# EAGLE design 2 byte output (EAGLE 9.4.2)
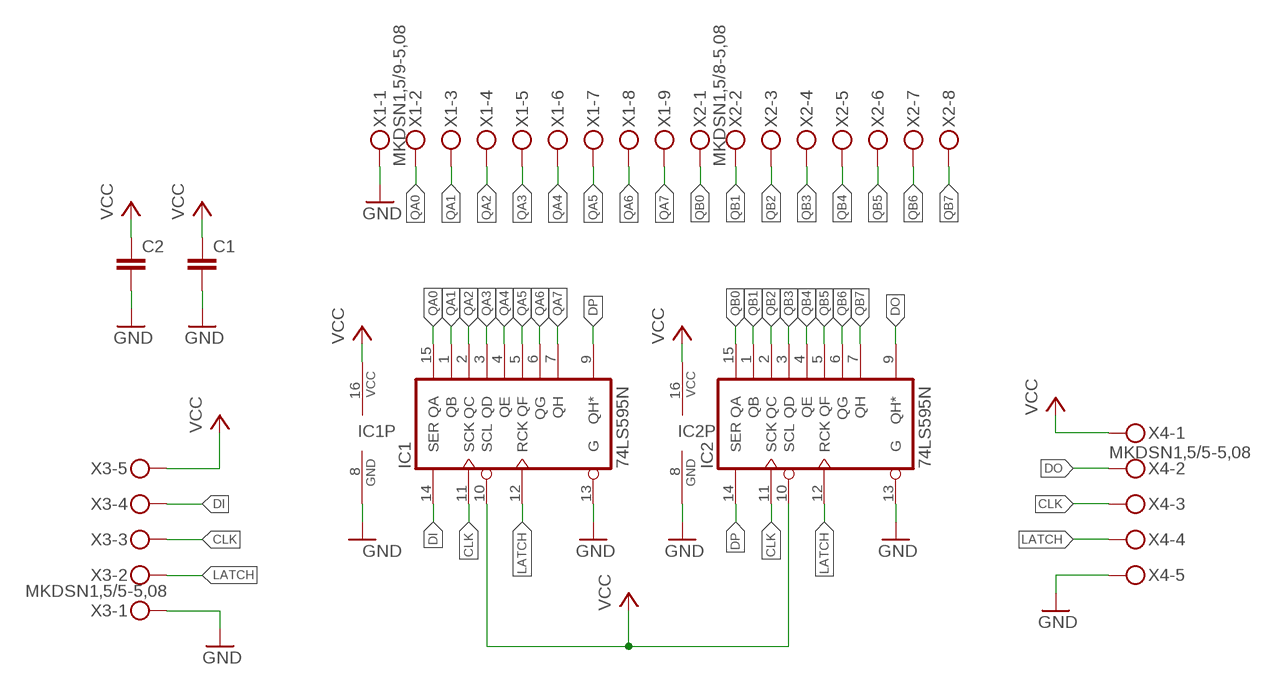
[diagram p0: schematic, sheet 1]

## Parts
C1  C-EU050-035X075  [C050-035X075]
C2  C-EU050-035X075  [C050-035X075]
IC1  74LS595N  [DIL16]
IC2  74LS595N  [DIL16]
X1  MKDSN1,5/9-5,08  [MKDSN1,5/9-5,08]
X2  MKDSN1,5/8-5,08  [MKDSN1,5/8-5,08]
X3  MKDSN1,5/5-5,08  [MKDSN1,5/5-5,08]
X4  MKDSN1,5/5-5,08  [MKDSN1,5/5-5,08]

## Nets
CLK: IC1.11(SCK) IC2.11(SCK) X3.3 X4.3
DI: IC1.14(SER) X3.4
DO: IC2.9(QH*) X4.2
DP: IC1.9(QH*) IC2.14(SER)
GND: C1.2 C2.2 IC1.8(GND) IC1.13(G) IC2.8(GND) IC2.13(G) X1.1 X3.1 X4.5
LATCH: IC1.12(RCK) IC2.12(RCK) X3.2 X4.4
QA0: IC1.15(QA) X1.2
QA1: IC1.1(QB) X1.3
QA2: IC1.2(QC) X1.4
QA3: IC1.3(QD) X1.5
QA4: IC1.4(QE) X1.6
QA5: IC1.5(QF) X1.7
QA6: IC1.6(QG) X1.8
QA7: IC1.7(QH) X1.9
QB0: IC2.15(QA) X2.1
QB1: IC2.1(QB) X2.2
QB2: IC2.2(QC) X2.3
QB3: IC2.3(QD) X2.4
QB4: IC2.4(QE) X2.5
QB5: IC2.5(QF) X2.6
QB6: IC2.6(QG) X2.7
QB7: IC2.7(QH) X2.8
VCC: C1.1 C2.1 IC1.10(SCL) IC1.16(VCC) IC2.10(SCL) IC2.16(VCC) X3.5 X4.1

## Library data of the parts
C1 C2 = resistor:C-EU: CAPACITOR, European symbol
IC1 IC2 = 74xx-us:74*595: 8-bit SHIFT REGISTER, output latch
X1 = con-phoenix-508:MKDSN1,5/9-5,08: MKDSN 1,5/ 9-5,08 Printklemme Nennstrom: 13,5 A Nennspannung: 250 V Rastermaß: 5,08 mm Polzahl: 9 Anschlussart: Schraubanschluss Montage: Löten Anschlussrichtung Leiter/Platine: 0 ° Artikelnummer: 1729199 Source: http://eshop.phoenixcontact.com .. 1729199.pdf
X2 = con-phoenix-508:MKDSN1,5/8-5,08: MKDSN 1,5/ 8-5,08 Printklemme Nennstrom: 13,5 A Nennspannung: 250 V Rastermaß: 5,08 mm Polzahl: 8 Anschlussart: Schraubanschluss Montage: Löten Anschlussrichtung Leiter/Platine: 0 ° Artikelnummer: 1729186 Source: http://eshop.phoenixcontact.com .. 1729186.pdf
X3 X4 = con-phoenix-508:MKDSN1,5/5-5,08: MKDSN 1,5/ 5-5,08 Printklemme Nennstrom: 13,5 A Nennspannung: 250 V Rastermaß: 5,08 mm Polzahl: 5 Anschlussart: Schraubanschluss Montage: Löten Anschlussrichtung Leiter/Platine: 0 ° Artikelnummer: 1729157 Source: http://eshop.phoenixcontact.com .. 1729157.pdf

## Board
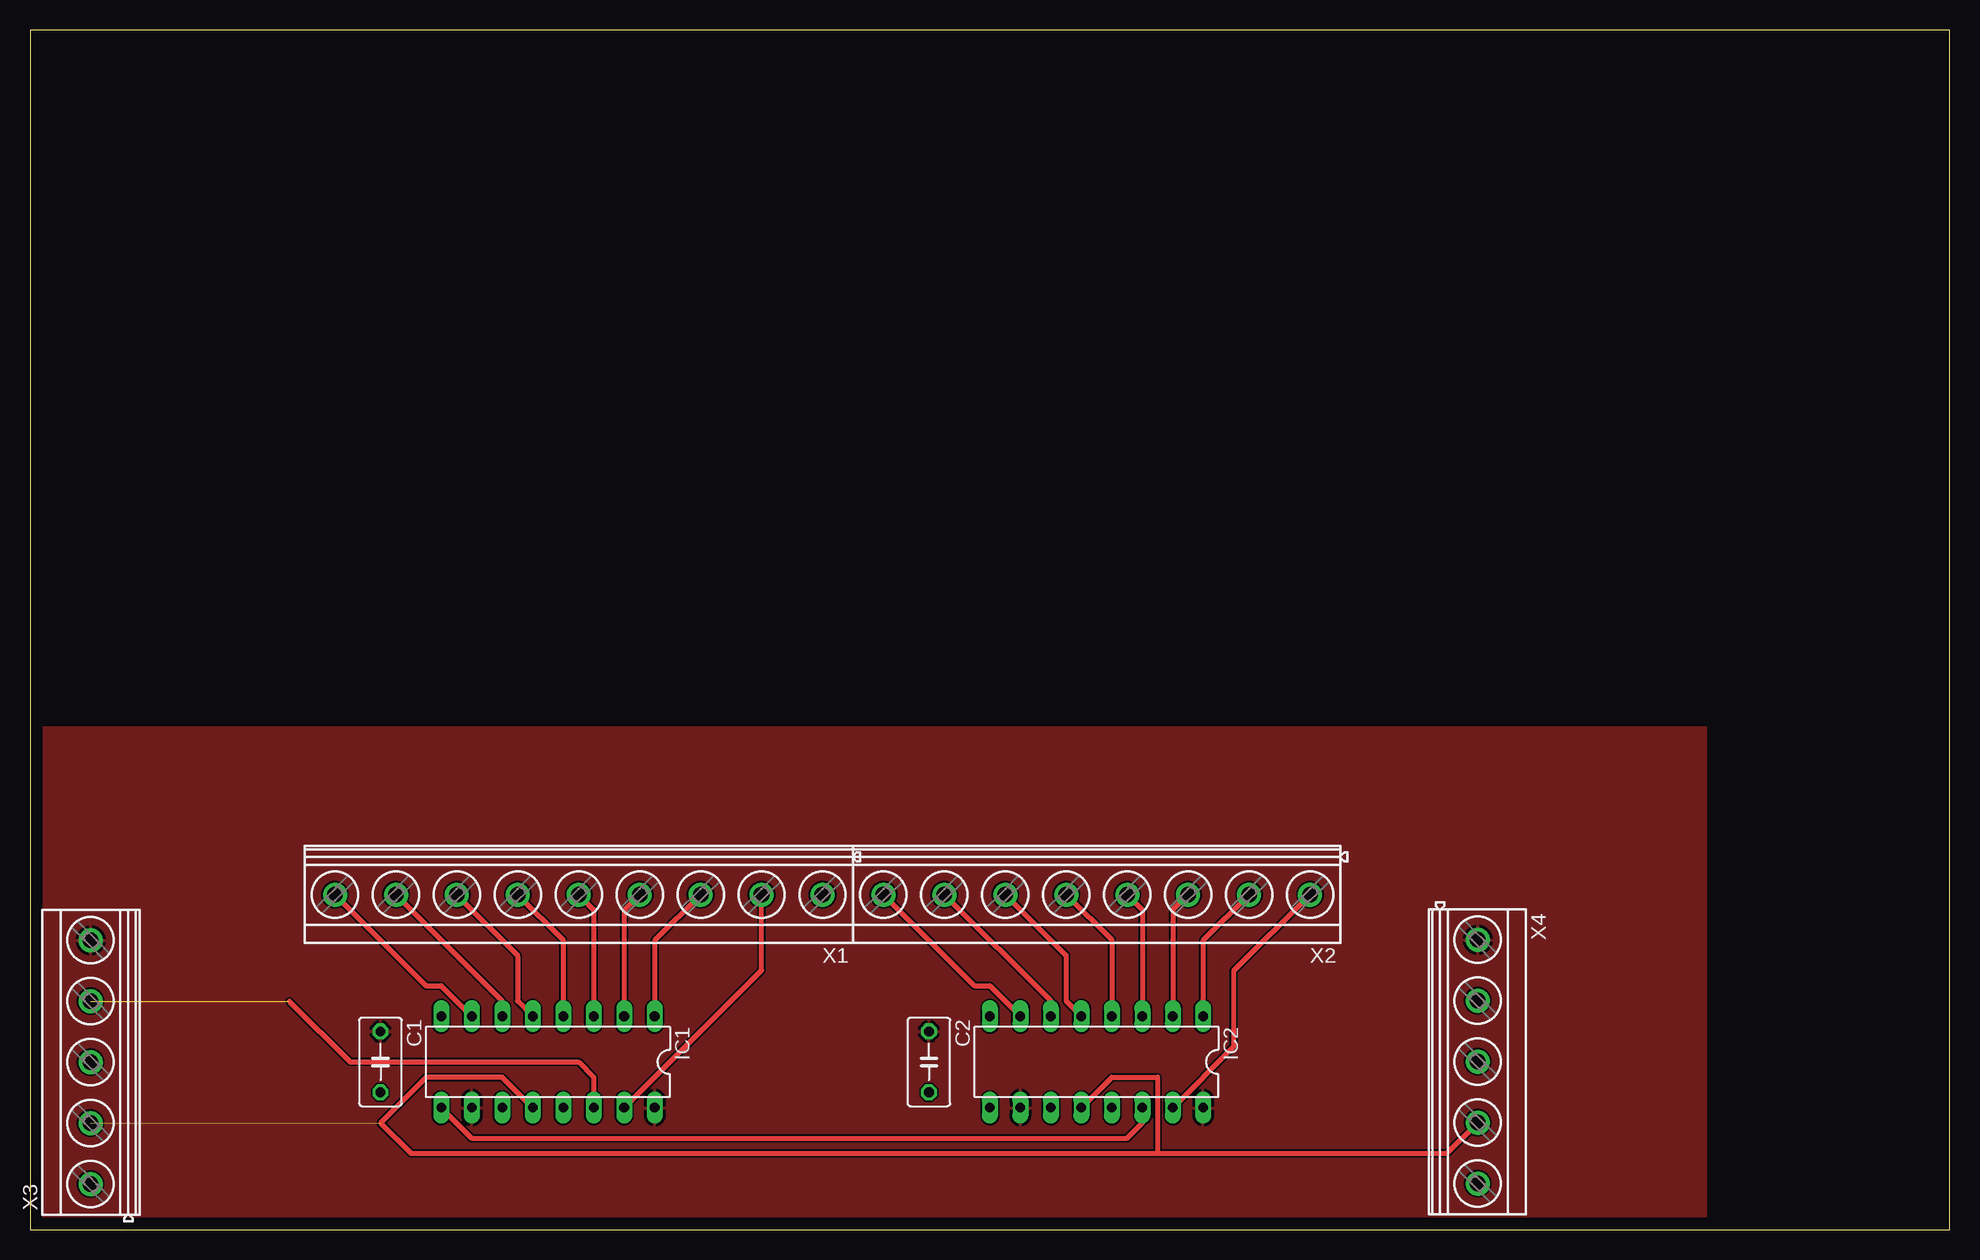
[diagram p1: board, top side]
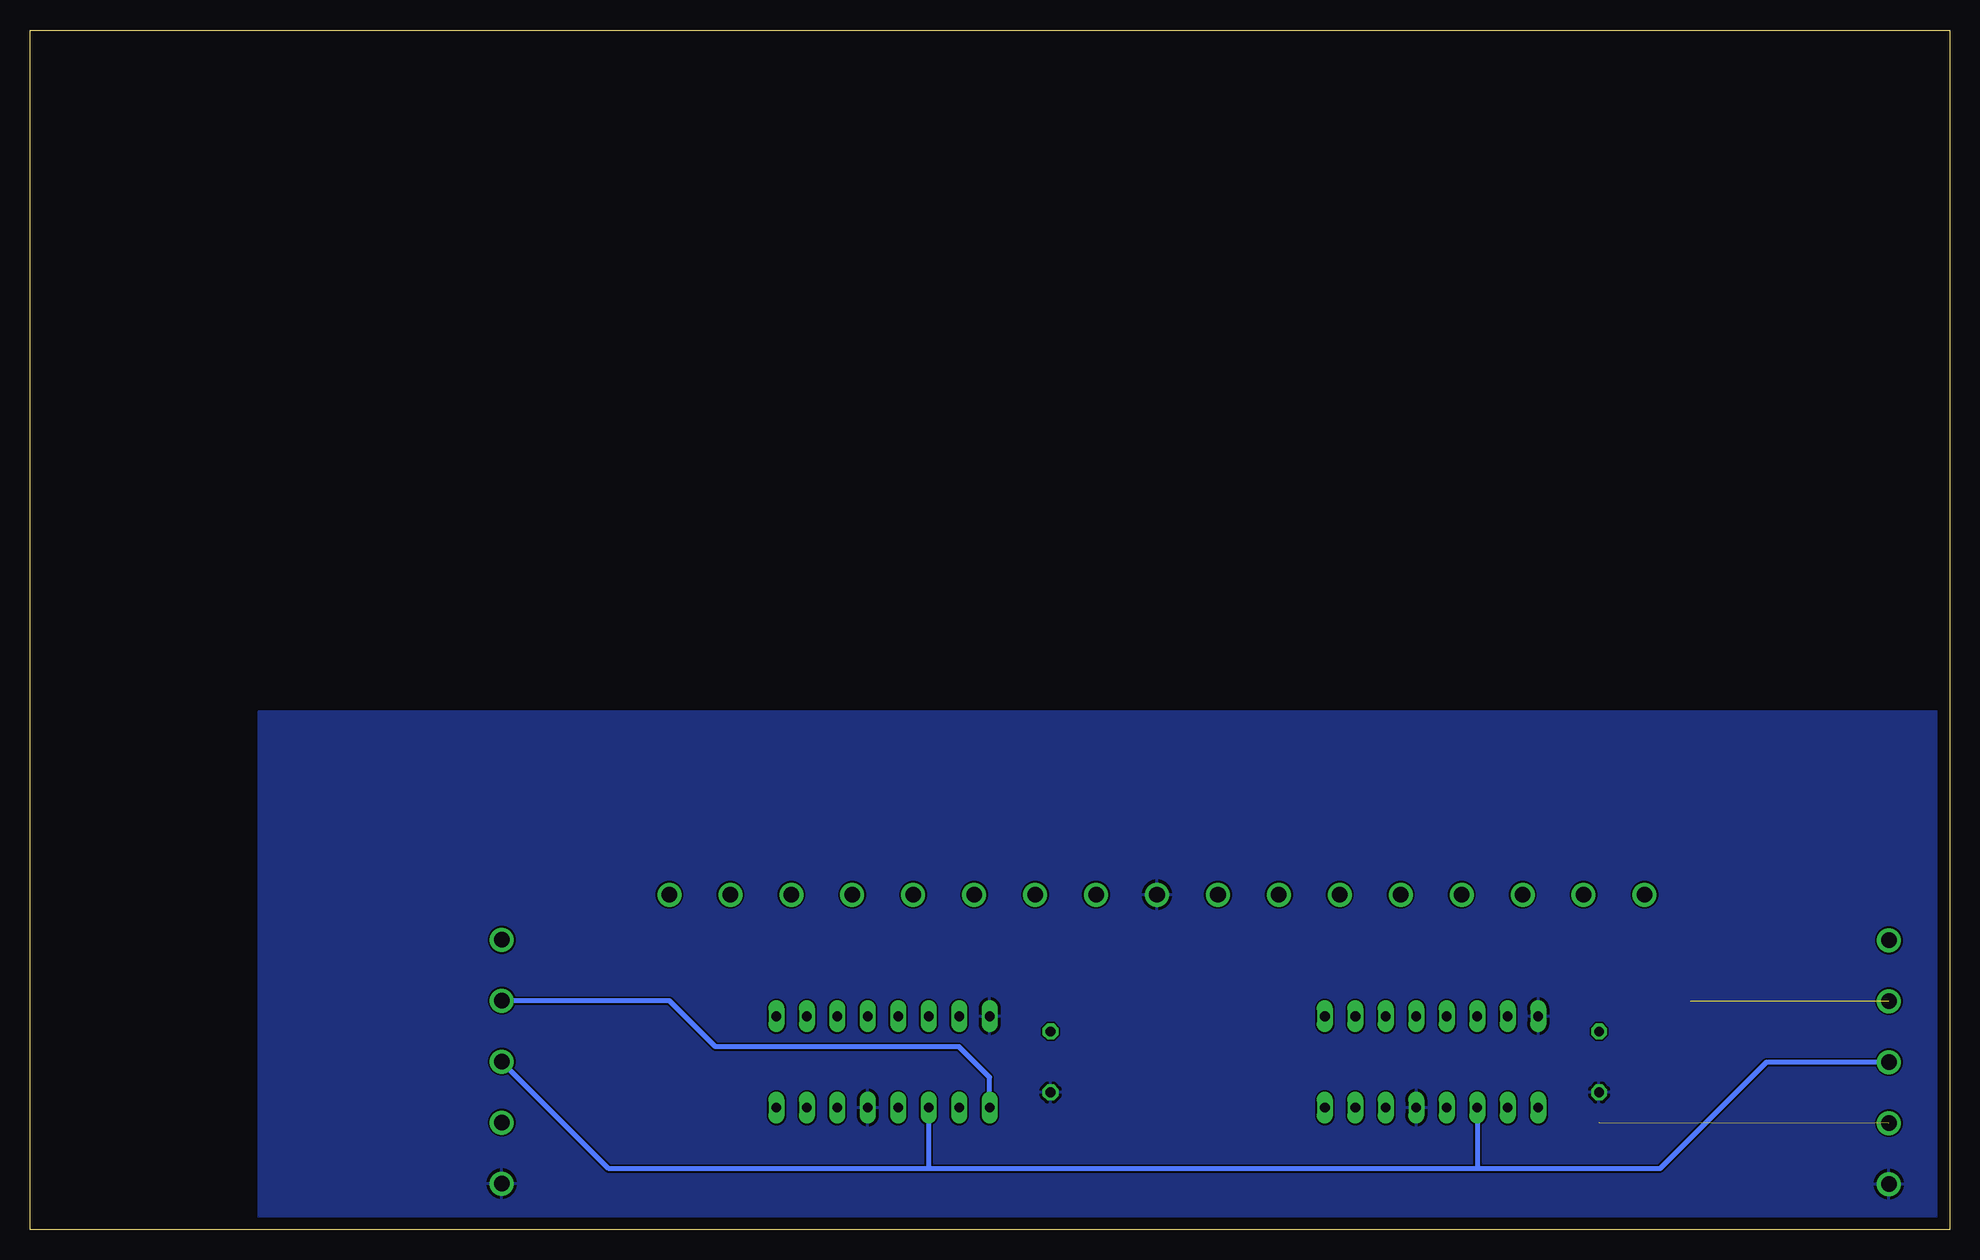
[diagram p2: board, bottom side, seen from below]

Size 160 x 100 mm. Coordinates in mm from the lower left corner, seen from the top.
Outline: 0,0 160,0 160,100 0,100 0,0
Copper layers (1*16): Top 0.035mm / dielectric 1.5mm / Bottom 0.035mm
Design rules "default": minimum track width 6mil, minimum drill 0.35mm, track to track 6mil, track to pad 6mil, pad to pad 6mil, via to via 6mil, smd to smd 6mil, copper to edge 40mil, drill to drill 6mil, minimum pad ring 10mil, minimum via ring 8mil, stop-mask expansion 4mil, vias tented up to drill 0mil, thermal gap 10mil

### Footprints (pad centres in the part's own frame; a part is rotated, then mirrored left to right if it is on the bottom)
C050-035X075 = drill 0.813 octagon: 1 -2.54,0; 2 2.54,0
DIL16 = drill 0.813 long: 1 -8.89,-3.81; 2 -6.35,-3.81; 3 -3.81,-3.81; 4 -1.27,-3.81; 5 1.27,-3.81; 6 3.81,-3.81; 7 6.35,-3.81; 8 8.89,-3.81; 9 8.89,3.81; 10 6.35,3.81; 11 3.81,3.81; 12 1.27,3.81; 13 -1.27,3.81; 14 -3.81,3.81; 15 -6.35,3.81; 16 -8.89,3.81
MKDSN1,5/9-5,08 = drill 1.3 pad 2: 1 -20.341,0.025; 2 -15.261,0.025; 3 -10.181,0.025; 4 -5.101,0.025; 5 -0.021,0.025; 6 5.059,0.025; 7 10.139,0.025; 8 15.219,0.025; 9 20.299,0.025
MKDSN1,5/8-5,08 = drill 1.3 pad 2: 1 -17.801,0.025; 2 -12.721,0.025; 3 -7.641,0.025; 4 -2.561,0.025; 5 2.519,0.025; 6 7.599,0.025; 7 12.679,0.025; 8 17.759,0.025
MKDSN1,5/5-5,08 = drill 1.3 pad 2: 1 -10.181,0.025; 2 -5.101,0.025; 3 -0.021,0.025; 4 5.059,0.025; 5 10.139,0.025

### Placement (x,y rotation side)
C1  29.21,13.97 270 top
C2  74.93,13.97 270 top
IC1  43.18,13.97 180 top
IC2  88.9,13.97 180 top
X1  45.72,27.94 180 top
X2  88.9,27.94 180 top
X3  5.08,13.97 90 top
X4  120.65,13.97 270 top

### Tracks (layer width: path | path; a pad name or v marks a point on that pad's centre or on a via)
CLK
  Bottom 0.406: X3.3 15.26,13.95 24.13,5.08 39.37,5.08 | 39.37,5.08 85.09,5.08 | 85.09,5.08 111.76,5.08 X4.3 | IC1.11 39.37,5.08 | IC2.11 85.09,5.08
DI  (1 unrouted)
  Top 0.406: 21.61,19.03 26.67,13.97 45.72,13.97 46.99,12.7 IC1.14
DO
  Bottom 0.406: IC2.9 80.01,12.7 82.55,15.24 102.87,15.24 106.7,19.07 X4.2
DP
  Top 0.406: IC1.9 36.83,7.62 91.44,7.62 92.71,8.89 IC2.14
GND
  pour Bottom: -6.35,43.18 140.97,43.18 140.97,-3.81 -6.35,-3.81
LATCH  (1 unrouted)
  Top 0.406: 93.98,6.35 31.75,6.35 29.23,8.87 29.23,8.91 33.02,12.7 39.37,12.7 IC1.12 | 93.98,6.35 118.11,6.35 X4.4 | IC2.12 90.17,12.7 93.98,12.7 93.98,6.35
QA0
  Top 0.406: IC1.15 60.98,21.61 X1.2
QA1
  Top 0.406: X1.3 52.07,24.08 IC1.1
QA2
  Top 0.406: X1.4 49.53,26.62 IC1.2
QA3
  Top 0.406: X1.5 46.99,26.67 IC1.3
QA4
  Top 0.406: X1.6 44.45,24.13 IC1.4
QA5
  Top 0.406: X1.7 40.64,22.86 40.64,19.05 IC1.5
QA6
  Top 0.406: X1.8 39.37,19.05 IC1.6
QA7
  Top 0.406: X1.9 33.02,20.32 34.29,20.32 IC1.7
QB0
  Top 0.406: X2.1 100.33,21.54 100.33,15.24 IC2.15
QB1
  Top 0.406: X2.2 97.79,24.08 IC2.1
QB2
  Top 0.406: X2.3 96.5,27.91 95.25,26.67 IC2.2
QB3
  Top 0.406: X2.4 92.71,26.67 IC2.3
QB4
  Top 0.406: X2.5 90.17,24.13 IC2.4
QB5
  Top 0.406: X2.6 86.36,22.86 86.36,19.05 IC2.5
QB6
  Top 0.406: X2.7 85.09,19.05 IC2.6
QB7
  Top 0.406: X2.8 78.74,20.32 80.01,20.32 IC2.7
VCC
  pour Top: -6.35,41.91 139.7,41.91 139.7,-2.54 -6.35,-2.54